# Altium schematic sheet Sheet1.SchDoc
size A4; SheetNumber: 1; SheetTotal: 1
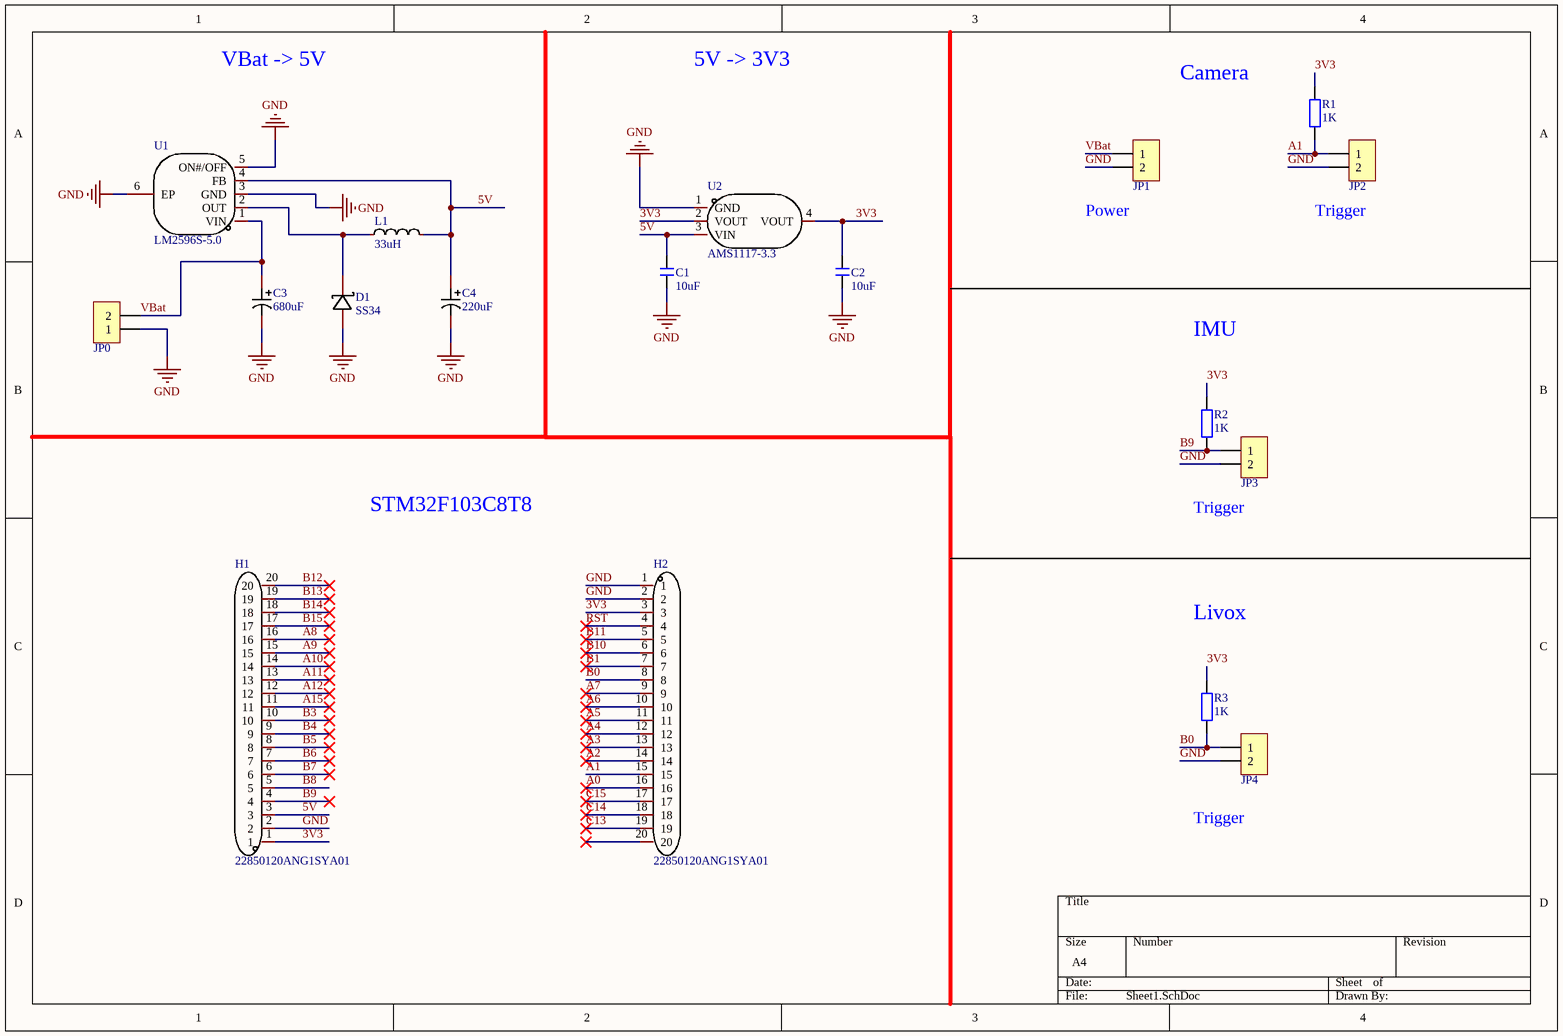
[diagram p0: Sheet1.SchDoc]

## Parts
C1  10uF  [C 0805_L]
C2  10uF  [C 0805_L]
C3  680uF  [CAP-SMD_BD10.0-L10.3-W10.3-LS11.3-FD-1]
C4  220uF  [CAP-SMD_BD6.3-L6.6-W6.6-LS7.4-FD]
D1  SS34  [DO-214AC_L4.3-W2.7-LS5.3-RD]
H1  22850120ANG1SYA01  [HDR-TH_20P-P2.54-V-F]
H2  22850120ANG1SYA01  [HDR-TH_20P-P2.54-V-F]
JP0  HDR-1X2  [XH2.54-LI-2P]  (value not drawn)
JP1  HDR-1X2  [XH2.54-LI-2P]  (value not drawn)
JP2  HDR-1X2  [XH2.54-LI-2P]  (value not drawn)
JP3  HDR-1X2  [XH2.54-LI-2P]  (value not drawn)
JP4  HDR-1X2  [XH2.54-LI-2P]  (value not drawn)
L1  33uH  [IND-SMD_L12.0-W12.0]
R1  1K  [R 0603_L]
R2  1K  [R 0603_L]
R3  1K  [R 0603_L]
U1  LM2596S-5.0  [TO-263-5_L10.2-W8.9-P1.70-BR]
U2  AMS1117-3.3  [SOT-223-3_L6.5-W3.4-P2.30-LS7.0-BR]

## Nets
GND: C1.1 C2.1 C3.2 C4.2 D1.2(A) H1.2 H2.1 H2.2 JP0.1 JP1.2 JP2.2 JP3.2 JP4.2 U1.3(GND) U1.5(ON#/OFF) U1.6(EP) U2.1(GND)
3V3: C2.2 H1.1 H2.3 R1.2 R2.2 R3.2 U2.2(VOUT) U2.4(VOUT)
5V: C1.2 C4.1 H1.3 L1.2 U1.4(FB) U2.3(VIN)
A0: H2.16
A1: H2.15 JP2.1 R1.1
A2: H2.14
A3: H2.13
A4: H2.12
A5: H2.11
A6: H2.10
A7: H2.9
A8: H1.16
A9: H1.15
A10: H1.14
A11: H1.13
A12: H1.12
A15: H1.11
B0: H2.8 JP4.1 R3.1
B1: H2.7
B3: H1.10
B4: H1.9
B5: H1.8
B6: H1.7
B7: H1.6
B8: H1.5
B9: H1.4 JP3.1 R2.1
B10: H2.6
B11: H2.5
B12: H1.20
B13: H1.19
B14: H1.18
B15: H1.17
C13: H2.19
C14: H2.18
C15: H2.17
RST: H2.4
VBat: C3.1 JP0.2 JP1.1 U1.1(VIN)
NetD1_1: D1.1(K) L1.1 U1.2(OUT)

Not connected (* = marked no-connect by the designer): H2 20*

## Notes on the sheet
- VBat -> 5V
- 5V -> 3V3
- Camera
- (near JP1) Power
- (near JP2) Trigger
- IMU
- STM32F103C8T8
- (near JP3) Trigger
- Livox
- (near JP4) Trigger

## Library data of the parts
C1 C2 = C: 无极性贴片电容; 版权归属: 源创客; BOM名称: 无极性贴片电容; 学习资源: www.ooocke.com
C3 = RVT1E681M1010: 容值:680uF;精度:±20%;额定电压:25V;电容体直径:10mm;电容体长度:10.2mm;纹波电流:-;等效串联电阻:-;工作寿命:2800hrs@105℃;工作温度:-55℃~+105℃;; Manufacturer: DMBJ(振宝佳); Add into BOM: yes; Tolerance: ±20%; Rated Voltage: 25V; φD: 10mm; L: 10.2mm; Symbol: RVT1E681M1010; Device: RVT1E681M1010; LCSC Part Name: 680uF ±20% 25V; Supplier Part: C976031; Manufacturer Part: RVT1E681M1010; Supplier Footprint: SMD,D10xL10.2mm; JLCPCB Part Class: Extended Part; Datasheet: https://atta.szlcsc.com/upload/public/pdf/source/20201217/C970594_282EC4D70669AEE33806F6C24A5FAA0B.pdf; Supplier: LCSC; Convert to PCB: yes; Value: 680uF; Ripple Current: -; Equivalent Series Resistance(ESR): -; Lifetime @ Temp: 2800hrs@105℃; Operating Temperature: -55℃~+105℃; Name: 680uF
C4 = RVT1E221M0607: 容值:220uF;精度:±20%;额定电压:25V;电容体直径:6.3mm;电容体长度:7.7mm;纹波电流:150mA@120Hz;等效串联电阻:-;工作寿命:-;工作温度:-40℃~+105℃;; Manufacturer: ROQANG(容强); Symbol: RVT1E221M0607_C2918361; Add into BOM: yes; Tolerance: ±20%; Rated Voltage: 25V; φD: 6.3mm; L: 7.7mm; Device: RVT1E221M0607; LCSC Part Name: 220uF ±20% 25V; Supplier Part: C2918361; Manufacturer Part: RVT1E221M0607; Supplier Footprint: SMD,D6.3xL7.7mm; JLCPCB Part Class: Extended Part; Datasheet: https://atta.szlcsc.com/upload/public/pdf/source/20211118/497C0614266278696CA52BDF245B991F.pdf; Supplier: LCSC; Convert to PCB: yes; Value: 220uF; Ripple Current: 150mA@120Hz; Equivalent Series Resistance(ESR): -; Lifetime @ Temp: -; Operating Temperature: -40℃~+105℃; Name: 220uF
D1 = SS34_C8678: 直流反向耐压(Vr):40V;平均整流电流(Io):3A;正向压降(Vf):550mV 3A;; Manufacturer: MDD; Add into BOM: yes; Reverse Voltage (Vr): 40V; Symbol: SS34_C8678; Device: SS34_C8678; LCSC Part Name: SS34; Supplier Part: C8678; Manufacturer Part: SS34; Supplier Footprint: SMA(DO-214AC); JLCPCB Part Class: Basic Part; Datasheet: https://atta.szlcsc.com/upload/public/pdf/source/20210506/C15874_5BDBC70F665BA444FCE0210303DB2A89.pdf; Supplier: LCSC; Convert to PCB: yes; Average Rectified Current (Io): 3A; Forward Voltage (Vf@If): 550mV 3A; Name: SS34
H1 H2 = 22850120ANG1SYA01: 排数:单排;总孔位数:20;间距:2.54mm;插孔结构:1x20P;行距:-;安装类型:直插;塑高:-;触头材质:黄铜;触头镀层:-;; Manufacturer: JILN(锦凌); Add into BOM: yes; Number of Holes: 20; Pitch: 2.54mm; Holes Structure: 1x20P; Symbol: 22850120ANG1SYA01; Device: 22850120ANG1SYA01; LCSC Part Name: 2.54mm 1x20P; Supplier Part: C429947; Manufacturer Part: 22850120ANG1SYA01; Supplier Footprint: 插件,P=2.54mm; JLCPCB Part Class: Extended Part; Datasheet: https://atta.szlcsc.com/upload/public/pdf/source/20190920/C429947_93151E92DD1E307A1E7C8E5576F8303C.pdf; Supplier: LCSC; Convert to PCB: yes; Number of Rows: 单排; Row Spacing: -; Mounting Type: 直插; Insulation Height: -; Contact Material: 黄铜; Contact Plating: -; Name: 22850120ANG1SYA01
JP0-JP4 = Header 2: 2P接插件; 版权归属: 源创客; BOM名称: 2P接插件; 学习资源: www.ooocke.com
L1 = SLH1207S330MTT: 精度:±20%;直流电阻(DCR):64.8mΩ;电感值:33uH;额定电流:3A;; Manufacturer: Sunltech(韩国顺磁); Add into BOM: yes; Tolerance: ±20%; DC Resistance (DCR): 64.8mΩ; Rated Current: 3A; Symbol: SLH1207S330MTT; Device: SLH1207S330MTT; LCSC Part Name: 33uH ±20%; Supplier Part: C181844; Manufacturer Part: SLH1207S330MTT; Supplier Footprint: SMD; JLCPCB Part Class: Extended Part; Datasheet: https://atta.szlcsc.com/upload/public/pdf/source/20180207/C181844_15179898935201356525.pdf; Supplier: LCSC; Convert to PCB: yes; Length: 12mm; Value: 33uH; Width: 12mm; Height: 8mm; Name: 33uH
R1-R3 = R: 贴片电阻; 版权归属: 源创客; BOM名称: 贴片电阻; 学习资源: www.ooocke.com
U1 = LM2596S-5.0_C347421: Manufacturer: UMW(广东友台半导体); Add into BOM: yes; Symbol: LM2596S-5.0; Device: LM2596S-5.0_C347421; LCSC Part Name: DC-DC芯片; Supplier Part: C347421; Manufacturer Part: LM2596S-5.0; Supplier Footprint: TO-263; JLCPCB Part Class: Extended Part; Datasheet: https://atta.szlcsc.com/upload/public/pdf/source/20211011/C7416AEF3194BD283261B8F2553C4145.pdf; Supplier: LCSC; Convert to PCB: yes; Name: LM2596S-5.0
U2 = AMS1117-3.3_C6186: 输出类型:固定;输出极性:正;最大输入电压:-;输出电压:3.3V;输出电流:1A;电源纹波抑制比(PSRR):72dB@(120Hz);; Manufacturer: AMS; Add into BOM: yes; Output Type: 固定; Output Polarity: 正; Number of Outputs: 1; Output Voltage: 3.3V; Dropout Voltage: 1.3V@(800mA); Output Current: 1A; Symbol: AMS1117-3.3; Device: AMS1117-3.3_C6186; LCSC Part Name: 正 Vout=3.3V 1A 72dB@(120Hz); Supplier Part: C6186; Manufacturer Part: AMS1117-3.3; Supplier Footprint: SOT-223; JLCPCB Part Class: Basic Part; Datasheet: https://atta.szlcsc.com/upload/public/pdf/source/20180727/C6186_7A095716F0823C02F1997A905E26C086.pdf; Supplier: LCSC; Convert to PCB: yes; Maximum Input Voltage: -; Quiescent Current (Ground Current): -; Power Supply Rejection Ratio (PSRR): 72dB@(120Hz); Noise: -; Feature: -; Operating Temperature: -; Name: AMS1117-3.3